# EAGLE design Esp12e_IR_repeater (EAGLE 9.6.1)
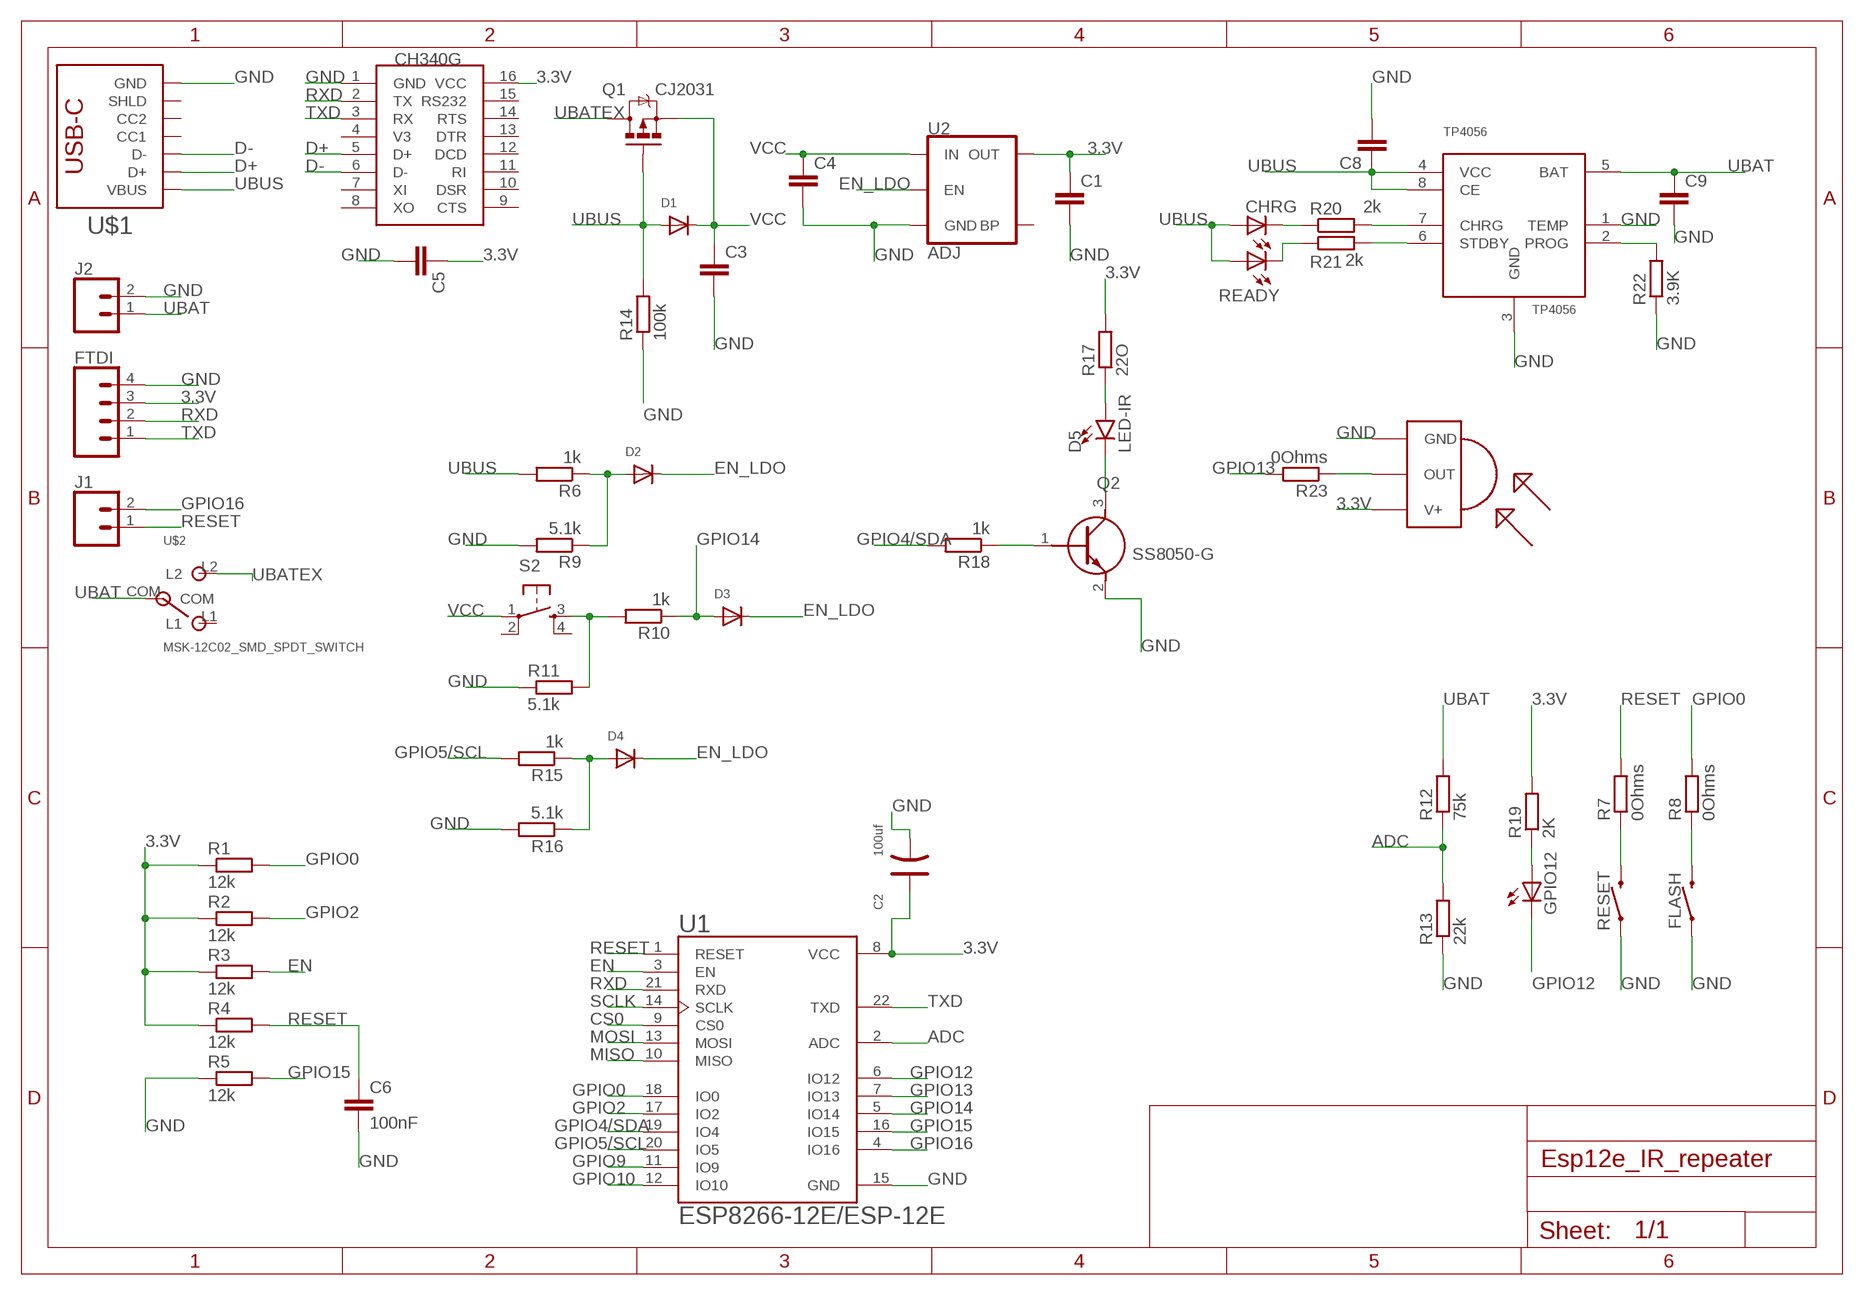
[diagram p0: schematic, sheet 1]

## Parts
C1  1uF  C_CHIP-0603(1608-METRIC)  [CAPC1608X85]
C2  100uf  TANTALUM-SMD-100UF-10V(AVX-B)  [AVX-B]
C3  1uF  C_CHIP-0603(1608-METRIC)  [CAPC1608X85]
C4  1uF  C_CHIP-0603(1608-METRIC)  [CAPC1608X85]
C5  1uF  C_CHIP-0603(1608-METRIC)  [CAPC1608X85]
C6  100nF  C-EUC0805  [C0805]
C8  10uF  C_CHIP-0603(1608-METRIC)  [CAPC1608X85]
C9  10uF  C_CHIP-0603(1608-METRIC)  [CAPC1608X85]
CHRG  LEDCHIPLED_0805  [CHIPLED_0805]
D1  DIODESOD-123  [SOD-123]
D2  DIODESOD-123  [SOD-123]
D3  DIODESOD-123  [SOD-123]
D4  DIODESOD-123  [SOD-123]
D5  LED-IR  LED-IRTSAL6100  [LED_5MM]
FLASH  RS032G05A3SM-SPST-MOMENTARY-SWSMD-1101NE  [TACTILE-SWITCH-1101NE]
FTDI  CONN_04  [1X04]
GPIO12  LEDCHIPLED_0805  [CHIPLED_0805]
J1  CONN_02  [1X02]
J2  CONN_02-JST-2-PTH-NO_SILK  [JST-2-PTH-NS]
Q1  CJ2031  MOSFET-PCHANNEL  [SOT23-3]
Q2  SS8050-G  [SOT95P240X115-3N]
R1  12k  R-EU_R0603  [R0603]
R2  12k  R-EU_R0603  [R0603]
R3  12k  R-EU_R0603  [R0603]
R4  12k  R-EU_R0603  [R0603]
R5  12k  R-EU_R0603  [R0603]
R6  1k  R-EU_R0603  [R0603]
R7  0Ohms  R-EU_R0603  [R0603]
R8  0Ohms  R-EU_R0603  [R0603]
R9  5.1k  R-EU_R0603  [R0603]
R10  1k  R-EU_R0603  [R0603]
R11  5.1k  R-EU_R0603  [R0603]
R12  75k  R-EU_R0603  [R0603]
R13  22k  R-EU_R0603  [R0603]
R14  100k  R-EU_R0603  [R0603]
R15  1k  R-EU_R0603  [R0603]
R16  5.1k  R-EU_R0603  [R0603]
R17  22O  R-EU_R0603  [R0603]
R18  1k  R-EU_R0603  [R0603]
R19  2K  R-EU_R0603  [R0603]
R20  2k  R-EU_R0603  [R0603]
R21  2k  R-EU_R0603  [R0603]
R22  3.9K  R-EU_R0603  [R0603]
R23  0Ohms  R-EU_R0603  [R0603]
READY  LEDCHIPLED_0805  [CHIPLED_0805]
RESET  RS032G05A3SM-SPST-MOMENTARY-SWSMD-1101NE  [TACTILE-SWITCH-1101NE]
S2  SWITCH-TACT_DTSM-6  [SWITCH-TACT_DTSM-6]
TP4056  TP4056  [SOP-8]
U1  ESP8266-12E/ESP-12E  [XCVR_ESP8266-12E/ESP-12E]
U2  ADJ  V_REG_MIC5205ADJ  [SOT23-5]
U$1  MOEKOE_USB_C_C393939  [MOEKOE_USBC_C393939]
U$2  MSK-12C02_SMD_SPDT_SWITCH  [MSK-12C02]
U$3  CH340G  [SOIC16]
U$4  TSOP1738  [TSOP17XX]

## Nets
3.3V: C1.1 C2.+ C5.1 FTDI.3 R1.1 R2.1 R3.1 R4.1 R17.2 R19.2 U1.8(VCC) U2.5(OUT) U$3.16(VCC) U$4.V+
ADC [Signal]: R12.1 R13.2 U1.2(ADC)
CS0 [Signal]: U1.9(CS0)
D+: U$1.A6(D+) U$1.B6(D+) U$3.5(D+)
D-: U$1.A7(D-) U$1.B7(D-) U$3.6(D-)
EN [Signal]: R3.2 U1.3(EN)
EN_LDO: D2.C D3.C D4.C U2.3(EN)
GND [GND]: C1.2 C2.- C3.2 C4.2 C5.2 C6.2 C8.2 C9.2 FLASH.1 FTDI.4 J2.2 Q2.2(E) R5.1 R9.2 R11.1 R13.1 R14.1 R16.2 R22.1 RESET.1 TP4056.1(TEMP) TP4056.3(GND) U1.15(GND) U2.2(GND) U$1.A1B12(GND) U$1.B1A12(GND) U$3.1(GND) U$4.GND
GPIO0 [Signal]: R1.2 R8.2 U1.18(IO0)
GPIO2 [Signal]: R2.2 U1.17(IO2)
GPIO4/SDA [Signal]: R18.2 U1.19(IO4)
GPIO5/SCL [Signal]: R15.2 U1.20(IO5)
GPIO9 [Signal]: U1.11(IO9)
GPIO10: U1.12(IO10)
GPIO12 [Signal]: GPIO12.C U1.6(IO12)
GPIO13 [Signal]: R23.2 U1.7(IO13)
GPIO14: D3.A R10.1 U1.5(IO14)
GPIO15 [Signal]: R5.2 U1.16(IO15)
GPIO16 [Signal]: J1.2 U1.4(IO16)
MISO [Signal]: U1.10(MISO)
MOSI [Signal]: U1.13(MOSI)
N$1: FLASH.2 R8.1
N$2 [Signal]: R7.1 RESET.2
N$3: D2.A R6.1 R9.1
N$4: D4.A R15.1 R16.1
N$5: R20.2 TP4056.7(CHRG)
N$6: R10.2 R11.2 S2.3
N$7: D5.A R17.1
N$8: D5.K(C) Q2.3(C)
N$9: Q2.1(B) R18.1
N$11: GPIO12.A R19.1
N$12: R21.2 TP4056.6(STDBY)
N$13: CHRG.C R20.1
N$14: R21.1 READY.C
N$15: R22.2 TP4056.2(PROG)
N$17: R23.1 U$4.OUT
RESET [Signal]: C6.1 J1.1 R4.2 R7.2 U1.1(RESET)
RXD [Signal]: FTDI.2 U1.21(RXD) U$3.2(TX)
SCLK [Signal]: U1.14(SCLK)
TXD [Signal]: FTDI.1 U1.22(TXD) U$3.3(RX)
UBAT [UBUS]: C9.1 J2.1 R12.2 TP4056.5(BAT) U$2.COM
UBATEX [UBUS]: Q1.3(D) U$2.L2
UBUS [UBUS]: C8.1 CHRG.A D1.A Q1.1(G) R6.2 R14.2 READY.A TP4056.4(VCC) TP4056.8(CE) U$1.A4B9(VBUS) U$1.B4A9(VBUS)
VCC: C3.1 C4.1 D1.C Q1.2(S) S2.1 U2.1(IN)
Unconnected: S2.2 S2.4 U2.4(BP) U$1.A5(CC1) U$1.B5(CC2) U$1.S1(SHLD) U$1.S2(SHLD) U$1.S3(SHLD) U$1.S4(SHLD) U$2.L1 U$3.4(V3) U$3.7(XI) U$3.8(XO) U$3.9(CTS) U$3.10(DSR) U$3.11(RI) U$3.12(DCD) U$3.13(DTR) U$3.14(RTS) U$3.15(RS232)

## Library data of the parts
C1 C3-C5 C8 C9 = Capacitor:C: Capacitor - Generic; CATEGORY: Capacitor; OC_NEWARK: unknown
C2 = OPL_Capacitor:TANTALUM-SMD-100UF-10V(AVX-B): 302020015; MPN: TAJB107M010#NJ
C6 = resistor:C-EU: CAPACITOR, European symbol; OC_NEWARK: unknown; SPICEPREFIX: C
CHRG GPIO12 READY = adafruit:LED: LED OSRAM: - CHIPLED LG R971, LG N971, LY N971, LG Q971, LY Q971, LO R971, LY R971 LH N974, LH R974 LS Q976, LO Q976, LY Q976 LO Q996 - Hyper CHIPLED LW Q18S LB Q993, LB Q99A, LB R99A - SideLED LS A670, LO A670, LY A670, LG A670, LP A670 LB A673, LV A673, LT A673, LW A673 LH A674 LY A675 LS A676, LA A676, LO A676, LY A676, LW A676 LS A679, LY A679, LG A679 - Hyper Micro SIDELED® LS Y876, LA Y876, LO Y876, LY Y876 LT Y87S - SmartLED LW L88C, LW L88S LB L89C, LB L89S, LG L890 LS L89K, LO L89K, LY L89K LS L896, LA L896, LO L896, LY L896 - TOPLED LS T670, LO T670, LY T670, LG T670, LP T670 LSG T670, LSP T670, LSY T670, LOP T670, LYG T670 LG T671, LOG T671, LSG T671 LB T673, LV T673, LT T673, LW T673 LH T674 LS T676, LA T676, LO T676, LY T676, LB T676, LH T676, LSB T676, LW T676 LB T67C, LV T67C, LT T67C, LS T67K, LO T67K, LY T67K, LW E67C LS E67B, LA E67B, LO E67B, LY E67B, LB E67C, LV E67C, LT E67C LW T67C LS T679, LY T679, LG T679 LS T770, LO T770, LY T770, LG T770, LP T770 LB T773, LV T773, LT T773, LW T773 LH T774 LS E675, LA E675, LY E675, LS T675 LS T776, LA T776, LO T776, LY T776, LB T776 LHGB T686 LT T68C, LB T68C - Hyper Mini TOPLED® LB M676 - Mini TOPLED Santana® LG M470 LS M47K, LO M47K, LY M47K Source: http://www.osram.convergy.de/; OC_NEWARK: unknown
D1 = adafruit:DIODE: Diode SMADIODE - SMA Surface Mount Package 20V 1A Schottky Diode Digikey: 641-1014-6-ND DO-1N4148 - Through Hole Small Current Diode SOD-123 20V 1 A (.5mV Vf) Schottky Diode - Digikey: MBRX120TPMSCT-ND SOD-323 10V 570mA (.38mV Vf, 3ns) Schottky Diode - Digikey: ZLLS410CT-ND SOD-523 30V 30mA Schottky Diode (RB751S-40TE61) - Digikey: RB751S-40TE61CT-ND SOT23-R/W - SOT23 Package (R = Solder Paste/Reflow Ovens, W = Hand-Soldering) BAT54Film 40V 300mA - Digikey: 497-7162-1-ND; OC_NEWARK: unknown; SPICEMODEL: DMOD; SPICEPREFIX: D
D2-D4 = adafruit:DIODE: Diode SMADIODE - SMA Surface Mount Package 20V 1A Schottky Diode Digikey: 641-1014-6-ND DO-1N4148 - Through Hole Small Current Diode SOD-123 20V 1 A (.5mV Vf) Schottky Diode - Digikey: MBRX120TPMSCT-ND SOD-323 10V 570mA (.38mV Vf, 3ns) Schottky Diode - Digikey: ZLLS410CT-ND SOD-523 30V 30mA Schottky Diode (RB751S-40TE61) - Digikey: RB751S-40TE61CT-ND SOT23-R/W - SOT23 Package (R = Solder Paste/Reflow Ovens, W = Hand-Soldering) BAT54Film 40V 300mA - Digikey: 497-7162-1-ND; OC_NEWARK: unknown
D5 = SparkFun-LED:LED-IR: Infrared LED (IR) Wavelength: 940nm Packages: TSAL6100 LTE302 - Side firing. Check SparkFun-Sensors.lbr for the receiver SparkFun Products: ZX Distance and Gesture Sensor <[https://www.sparkfun.com/products/12780]> Infrared Emitters and Detectors <https://www.sparkfun.com/products/241>; PROD_ID: DIO-12058
FLASH RESET = BeagleBone_Blue_R3:RS032G05A3SM-SPST-MOMENTARY-SW: 6x3.5mm 2-pin Momentary Switch (Push-button) Digikey Link <https://www.digikey.com/products/en?keywords=CKN10388TR-ND> Datasheet <https://media.digikey.com/pdf/Data%20Sheets/C&K/RS-032G05_-SM_RT.pdf>; OC_NEWARK: unknown; PROD_ID: SWCH-00815
FTDI = SparkFun-Connectors:CONN_04: Multi connection point. Often used as Generic Header-pin footprint for 0.1 inch spaced/style header connections On any of the 0.1 inch spaced packages, you can populate with these: Break Away Headers - Straight <https://www.sparkfun.com/products/116> (PRT-00116) Break Away Male Headers - Right Angle <https://www.sparkfun.com/products/553> (PRT-00553) Female Headers <https://www.sparkfun.com/products/115> (PRT-00115) Break Away Headers - Machine Pin <https://www.sparkfun.com/products/117> (PRT-00117) Break Away Female Headers - Swiss Machine Pin <https://www.sparkfun.com/products/743> (PRT-00743) For SCREWTERMINALS and SPRING TERMINALS visit here: Screw Terimnals on SparkFun.com <https://www.sparkfun.com/search/results?term=Screw+Terminals> (5mm/3.5mm/2.54mm spacing) This device is also useful as a general connection point to wire up your design to another part of your project. Our various solder wires solder well into these plated through hole pads. Hook-Up Wire - Assortment (Stranded, 22 AWG) <https://www.sparkfun.com/products/11375> (PRT-11375) Hook-Up Wire - Assortment (Solid Core, 22 AWG) <https://www.sparkfun.com/products/11367> (PRT-11367) View the entire wire category on our website here <https://www.sparkfun.com/categories/141> Special notes: Molex polarized connector foot print use with SKU : PRT-08231 with associated crimp pins and housings. 1MM SMD Version SKU: PRT-10208; OC_NEWARK: unknown; PROD_ID: CONN-09696
J1 J2 = SparkFun-Connectors:CONN_02: Multi connection point. Often used as Generic Header-pin footprint for 0.1 inch spaced/style header connections On any of the 0.1 inch spaced packages, you can populate with these: Break Away Headers - Straight <https://www.sparkfun.com/products/116> (PRT-00116) Break Away Male Headers - Right Angle <https://www.sparkfun.com/products/553> (PRT-00553) Female Headers <https://www.sparkfun.com/products/115> (PRT-00115) Break Away Headers - Machine Pin <https://www.sparkfun.com/products/117> (PRT-00117) Break Away Female Headers - Swiss Machine Pin <https://www.sparkfun.com/products/743> (PRT-00743) For SCREWTERMINALS and SPRING TERMINALS visit here: Screw Terimnals on SparkFun.com <https://www.sparkfun.com/search/results?term=Screw+Terminals> (5mm/3.5mm/2.54mm spacing) This device is also useful as a general connection point to wire up your design to another part of your project. Our various solder wires solder well into these plated through hole pads. Hook-Up Wire - Assortment (Stranded, 22 AWG) <https://www.sparkfun.com/products/11375> (PRT-11375) Hook-Up Wire - Assortment (Solid Core, 22 AWG) <https://www.sparkfun.com/products/11367> (PRT-11367) View the entire wire category on our website here <https://www.sparkfun.com/categories/141> Special notes: Molex polarized connector foot print use with: PRT-08233 with associated crimp pins and housings. 2.54_SCREWTERM for use with PRT-10571. 3.5mm Screw Terminal footprints for PRT-08084 5mm Screw Terminal footprints for use with PRT-08432
Q1 = User-Submitted:MOSFET-PCHANNEL: Generic PMOSFET IRLML2244 - TRANS-11153 (SOT-23 -20V -4.3A) (1.Gate 2.Source 3.Drain) FQP27P06 - COM-10349 <http://www.sparkfun.com/products/10349> (TO-220 -60V -27A) (1.Gate 2.Source 3.Drain); OC_NEWARK: unknown; PROD_ID: TRANS-08285; SPICEMODEL: PFET; SPICEPREFIX: M
Q2 = SS8050-G:SS8050-G: Bipolar Transistors - BJT NPN TRANSISTOR 1.5A 40V Source: Datasheet <http://www.comchiptech.com/admin/files/product/SS8050-G RevA181526.pdf> Check prices <https://pricing.snapeda.com/parts/SS8050-G/Comchip%20Technology/view-part?ref=eda>; AVAILABILITY: In Stock; DESCRIPTION: Bipolar (BJT) Transistor NPN 25V 1.5A 100MHz 300mW Surface Mount SOT-23-3; MF: Comchip Technology; MP: SS8050-G; PACKAGE: TO-236 Comchip; PRICE: None; PURCHASE-URL: https://pricing.snapeda.com/search/part/SS8050-G/?ref=eda
R1-R23 = resistor:R-EU_: RESISTOR, European symbol; OC_NEWARK: unknown; SPICEPREFIX: R
S2 = Esp32_buttons_V2:SWITCH-TACT_DTSM-6
TP4056 = TP4056:TP4056; AVAILABILITY: Unavailable; DESCRIPTION: Complete single cell Li-Ion battery with a constant current / constant voltage linear charger; MF: NanJing Top Power ASIC Corp.; MP: TP4056; PACKAGE: Package Analog Devices; PRICE: None
U1 = ESP8266-12E_ESP-12E:ESP8266-12E/ESP-12E: ESP-12E WiFi Module; AVAILABILITY: Unavailable; DESCRIPTION: This WiFi module has a 32-bit MCU micro and clock speeds supporting 80 MHz or 160 MHz. Supports the RTOS and integrated Wi-Fi MAC/BB/RF/PA/LNA, and has an on-board antenna.; MF: AI-Thinker; MP: ESP8266-12E/ESP-12E; OC_NEWARK: unknown; PACKAGE: None; PRICE: None
U2 = SparkFun-IC-Power:V_REG_MIC5205: V_REG MIC5205 Standard 3.3V, 5V, and Adjustable 150mA LDO voltage regulator in SOT-23 layout. Micrel part MIC5205. BP (by-pass) pin is used to lower output noise with 470pF cap, may be left open. On the adjustable version BP is used to set output.; OC_NEWARK: unknown; PROD_ID: VREG-12594; SPICEPREFIX: X
U$1 = pico32_remote_v1_1:MOEKOE_USB_C_C393939
U$2 = MSK-12C02 SMD Micro Slider Switch SPDT:MSK-12C02_SMD_SPDT_SWITCH: Footprint of the VIMEX MSK-12C02 SPDT SMD Switch Created by mzst on 17-Jan-2016
U$3 = ch340g:CH340G
U$4 = TSOP1738:TSOP1738: IR Receiver and Demodulator Check prices <https://pricing.snapeda.com/parts/TSOP1738./Vishay/view-part?ref=eda>; AVAILABILITY: Not in stock; DESCRIPTION: IR Remote Receiver 38KHz 35m 3-Pin; MF: Vishay; MP: TSOP1738.; PACKAGE: DIP-3 Vishay; PRICE: None

## Net classes
0 3.3v: width 0.25 mm
1 Signal: width 0.25 mm
2 GND: width 0.25 mm
3 UBUS: width 0.3 mm

## Board
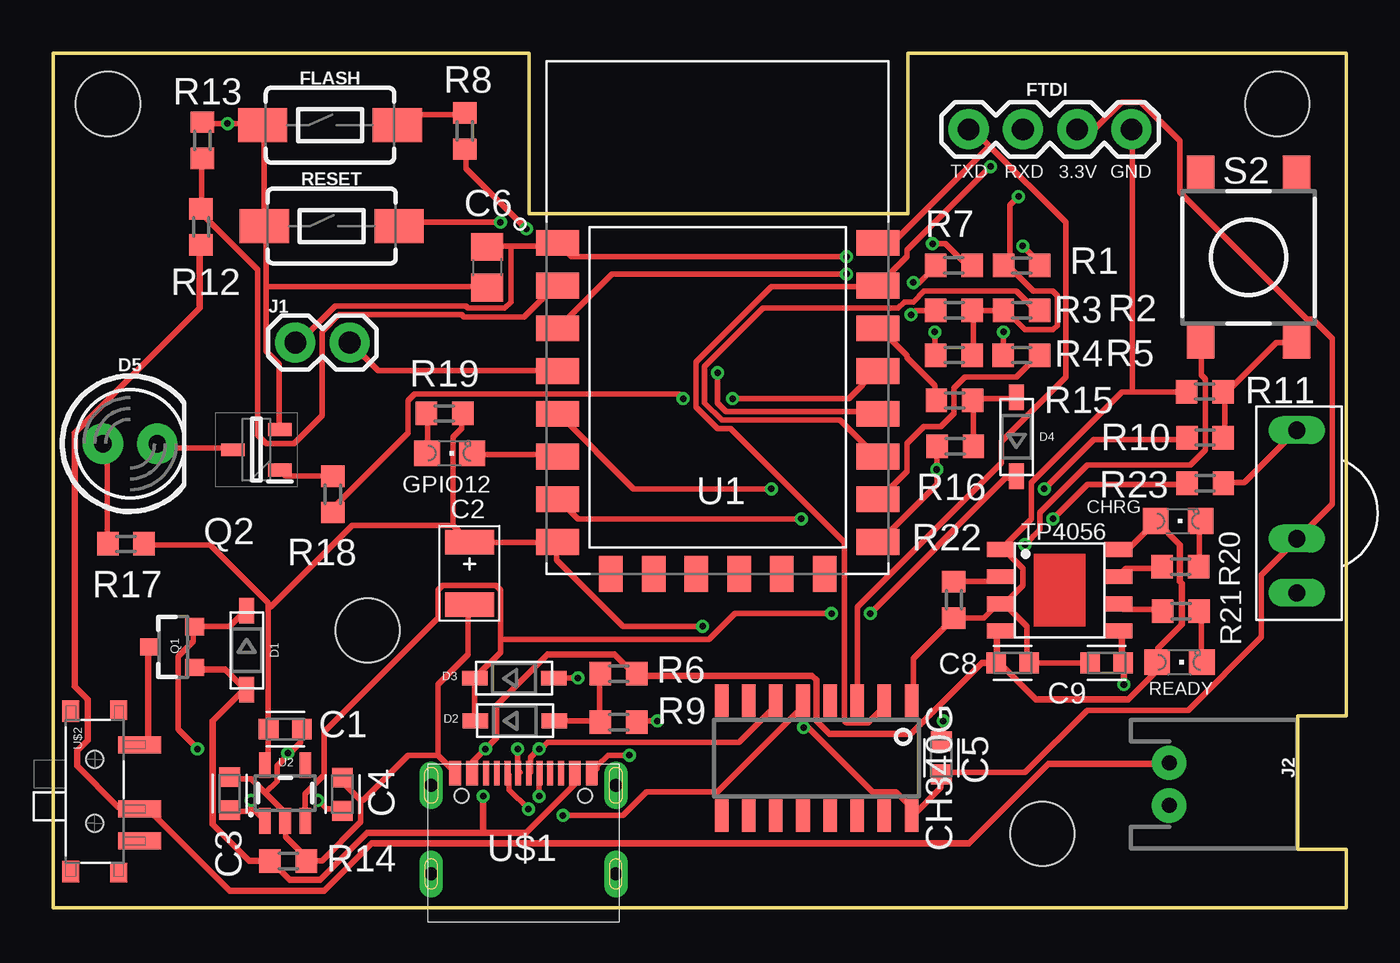
[diagram p1: board, top side]
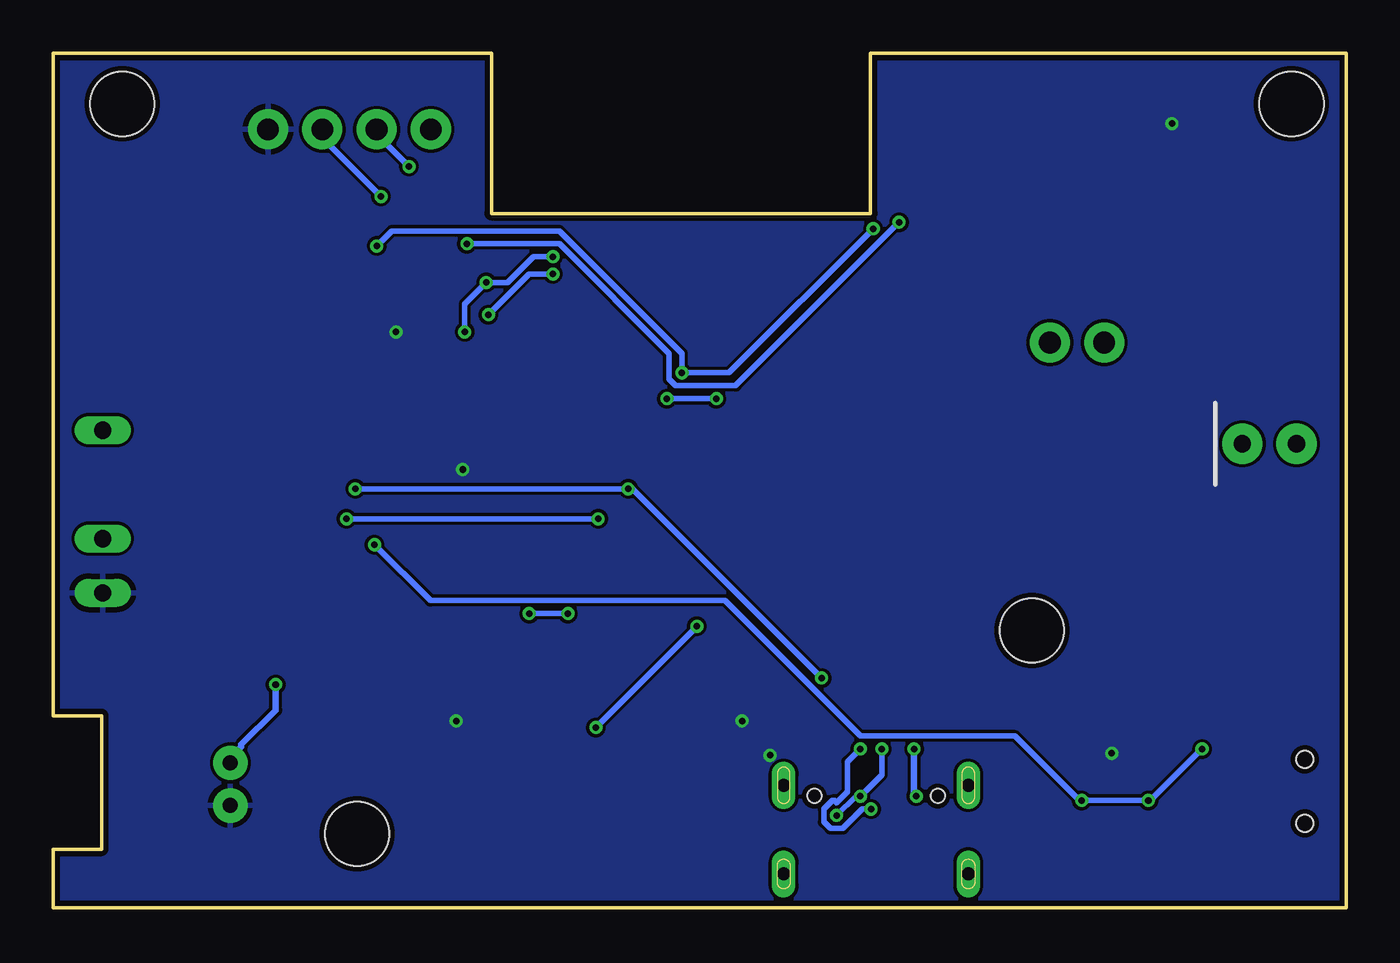
[diagram p2: board, bottom side, seen from below]

Size 60.5 x 40 mm. Coordinates in mm from the lower left corner, seen from the top.
Outline: 22.25,32.5 22.25,40 0,40 0,0 60.5,0 60.5,2.75 58.25,2.75 58.25,9 60.5,9 60.5,40 40,40 40,32.5 22.25,32.5
Copper layers (1*16): Top 0.035mm / dielectric 1.5mm / Bottom 0.035mm
Design rules "SeeedStudio_2layer_DRU_no_angle_20140221": minimum track width 6mil, minimum drill 12mil, track to track 6mil, track to pad 6mil, pad to pad 6mil, via to via 6mil, smd to smd 0mil, copper to edge 10mil, drill to drill 10mil, minimum pad ring 10mil, minimum via ring 6mil, stop-mask expansion 2mil, vias tented up to drill 100mil, thermal gap 10mil
Holes 3 mm at 2.56,37.63 46.29,3.46 57.27,37.63 14.71,12.99

### Footprints (pad centres in the part's own frame; a part is rotated, then mirrored left to right if it is on the bottom)
CAPC1608X85 = smd 0.921 x 0.97: 1 -0.775,0; 2 0.775,0
AVX-B = smd 1.143 x 2.286: + -1.46,0; - 1.46,0
C0805 = smd 1.3 x 1.5: 1 -0.95,0; 2 0.95,0
CHIPLED_0805 = smd 1.2 x 1.2: A 0,-1.05; C 0,1.05
SOD-123 = smd 1.2 x 0.7: A 1.85,0; C -1.85,0
LED_5MM = drill 0.813 pad 1.88: A -1.27,0; K 1.27,0
TACTILE-SWITCH-1101NE = smd 2.3 x 1.6: 1 -3.15,0; 2 3.15,0
1X04 = drill 1.016 pad 1.88: 1 0,0; 2 2.54,0; 3 5.08,0; 4 7.62,0
1X02 = drill 1.016 pad 1.88: 1 0,0; 2 2.54,0
JST-2-PTH-NS = drill 0.7 pad 1.6: 1 -1,0; 2 1,0
SOT23-3 = smd 0.8 x 0.9: 1 -0.95,-1; 2 0.95,-1; 3 0,1.1
SOT95P240X115-3N = smd 1.1 x 0.6: 1 -1.1,0.95; 2 -1.1,-0.95; 3 1.1,0
R0603 = smd 1 x 1.1: 1 -0.85,0; 2 0.85,0
SWITCH-TACT_DTSM-6 = smd 1.55 x 1.3: 1 -3.975,2.25; 2 3.975,2.25; 3 -3.975,-2.25; 4 3.975,-2.25
SOP-8 = smd 1.3 x 0.7: 1 -2.75,1.905; 2 -2.75,0.635; 3 -2.75,-0.635; 4 -2.75,-1.905; 5 2.75,-1.905; 6 2.75,-0.635; 7 2.75,0.635; 8 2.75,1.905
XCVR_ESP8266-12E/ESP-12E = smd 2 x 1.2: 1 -7.5,7; 2 -7.5,5; 3 -7.5,3; 4 -7.5,1; 5 -7.5,-1; 6 -7.5,-3; 7 -7.5,-5; 8 -7.5,-7; 15 7.5,-7; 16 7.5,-5; 17 7.5,-3; 18 7.5,-1; 19 7.5,1; 20 7.5,3; 21 7.5,5; 22 7.5,7 | smd 1.1 x 1.7: 9 -5,-8.5; 10 -3,-8.5; 11 -1,-8.5; 12 1,-8.5; 13 3,-8.5; 14 5,-8.5
SOT23-5 = smd 0.55 x 1.2: 1 -0.95,-1.3; 2 0,-1.3; 3 0.95,-1.3; 4 0.95,1.3; 5 -0.95,1.3
MOEKOE_USBC_C393939 = smd 0.55 x 1.15: A1B12 -3.2,0.575; A4B9 -2.4,0.575; B1A12 3.2,0.575; B4A9 2.4,0.575 | smd 0.275 x 1.15: A5 -1.25,0.575; A6 -0.25,0.575; A7 0.25,0.575; B5 1.75,0.575; B6 0.75,0.575; B7 -0.75,0.575; B8 1.25,0.575 | smd 0.3 x 1.15: A8 -1.75,0.575 | drill 0.6 pad 1 long: S1 -4.32,0; S2 4.32,0; S3 -4.32,-4.15; S4 4.32,-4.15 | hole 0.65: 2.89,-0.5; -2.89,-0.5
MSK-12C02 = smd 0.8 x 2: COM 0.823,2.1; L1 2.323,2.1; L2 -2.177,2.1 | smd 1 x 0.8: GND@1 -3.75,-1.125; GND@4 3.75,-1.125 | smd 0.9 x 0.8: GND@2 -3.8,1.125; GND@3 3.8,1.125 | hole 0.8: -1.5,0; 1.5,0
SOIC16 = smd 0.635 x 1.524: 1 -4.445,-2.695; 2 -3.175,-2.695; 3 -1.905,-2.695; 4 -0.635,-2.695; 5 0.635,-2.695; 6 1.905,-2.695; 7 3.175,-2.695; 8 4.445,-2.695; 9 4.445,2.695; 10 3.175,2.695; 11 1.905,2.695; 12 0.635,2.695; 13 -0.635,2.695; 14 -1.905,2.695; 15 -3.175,2.695; 16 -4.445,2.695
TSOP17XX = drill 0.813 long: GND -3.81,0; OUT 3.81,0; V+ -1.27,0

### Placement (x,y rotation side)
C1  10.85,8.37 0 top
C2  19.47,15.66 270 top
C3  8.24,5.36 90 top
C4  13.53,5.32 90 top
C5  41.55,7.03 90 top
C6  20.3,29.99 270 top
C8  44.9,11.47 0 top
C9  49.3,11.47 180 top
CHRG  52.63,18.11 270 top
D1  9.05,12.06 270 top
D2  21.6,8.77 0 top
D3  21.57,10.76 0 top
D4  45.08,22.05 90 top
D5  3.59,21.73 0 top
FLASH  12.94,36.64 0 top
FTDI  42.84,36.45 0 top
GPIO12  18.54,21.29 270 top
J1  11.32,26.46 0 top
J2  52.22,5.79 270 top
Q1  5.61,12.22 90 top
Q2  9.5,21.45 180 top
R1  45.31,30.07 0 top
R2  45.31,27.97 0 top
R3  42.15,27.98 180 top
R4  42.15,25.88 180 top
R5  45.31,25.87 0 top
R6  26.45,10.97 0 top
R7  42.14,30.08 180 top
R8  19.25,36.37 270 top
R9  26.45,8.7 0 top
R10  53.9,22.02 0 top
R11  53.88,24.17 0 top
R12  6.91,31.88 270 top
R13  6.97,35.93 270 top
R14  10.99,2.19 180 top
R15  42.17,23.75 180 top
R16  42.2,21.61 180 top
R17  3.4,17.04 0 top
R18  13.08,19.36 270 top
R19  18.31,23.15 0 top
R20  52.74,15.97 180 top
R21  52.77,13.89 180 top
R22  42.15,14.42 90 top
R23  53.91,19.88 180 top
READY  52.7,11.5 270 top
RESET  13.02,31.92 0 top
S2  55.94,30.45 90 top
TP4056  47.09,14.87 0 top
U1  31.09,24.13 0 top
U2  10.85,5.38 0 top
U$1  22,5.74 0 top
U$2  1.94,5.46 270 top
U$3  35.72,7.01 180 top
U$4  58.2,18.55 90 top

### Tracks (layer width: path | path; a pad name or v marks a point on that pad's centre or on a via)
3.3V  (via drill 0.3)
  Top 0.25: 18.71,17.91 18.71,22.03 19.11,22.43 19.11,23.14 R19.2 | 18.71,17.91 19.42,17.2 C2.+ 19.52,17.1 23.54,17.1 U1.8 23.54,17 23.54,16.3 26.66,13.18 v30.38,13.18 | U2.5 9.96,6.74 10.06,6.84 10.06,8.35 C1.1 10.06,8.45 10.06,14.08 | 10.06,14.08 10.06,14.29 7.34,17 4.33,17 R17.2 | 18.71,17.91 13.98,17.91 10.16,14.08 10.06,14.08 | R4.1 43.06,25.95 43.06,27.97 R3.1 43.16,27.97 44.37,27.97 R2.1 44.57,27.97 45.47,27.06 46.78,27.06 46.98,27.26 46.98,28.67 46.78,28.87 45.87,28.87 44.77,29.98 44.47,29.98 R1.1 44.77,30.08 44.77,32.9 v45.17,33.3 | FTDI.3 47.99,36.52 48.79,36.52 50,37.73 50.9,37.73 52.71,35.91 52.71,33.5 58.65,27.56 58.95,27.56 59.86,26.66 59.86,18.91 58.25,17.3 U$4.V+ 58.15,17.2 56.54,15.59 56.54,12.68 53.12,9.26 48.39,9.26 45.47,6.34 41.65,6.34 C5.1 41.55,6.24 41.55,5.63 40.24,4.33 U$3.16 40.34,4.53 39.44,5.43 38.33,5.43 35.31,8.45 v35.11,8.45
  Bottom 0.25: v45.17,33.3 47.89,36.02 47.89,36.42 FTDI.3 | v35.11,8.45 v30.38,13.18
ADC
  Top 0.25: R13.2 6.94,35.01 6.94,32.8 R12.1 6.94,32.7 6.94,32.49 9.56,29.88 9.56,22.13 9.96,21.73 11.27,21.73 12.57,23.04 12.57,26.96 13.38,27.77 19.11,27.77 19.21,27.66 22.03,27.66 23.54,29.17 U1.2
D+  (via drill 0.3)
  Top 0.25: v21.73,7.44 21.73,6.44 21.83,6.34 U$1.A6 | v22.74,5.23 22.74,6.24 U$1.B6 | v23.84,4.33 26.66,4.33 27.77,5.43 31.09,5.43 35.01,9.36 35.01,9.66 U$3.5
  Bottom 0.25: v21.73,7.44 21.73,6.24 v22.74,5.23 22.94,5.23 v23.84,4.33
D-  (via drill 0.3)
  Top 0.25: v22.23,4.63 21.33,5.53 21.33,6.24 U$1.B7 | U$1.A7 22.33,6.34 22.33,7.04 v22.74,7.44 22.84,7.44 23.14,7.75 32.09,7.75 33.8,9.46 33.8,9.66 U$3.6
  Bottom 0.25: v22.23,4.63 22.64,4.63 23.54,3.72 24.14,3.72 24.45,4.02 24.45,4.63 24.04,5.03 23.94,5.03 23.84,4.93 23.34,5.43 23.34,6.84 v22.74,7.44
EN  (via drill 0.3)
  Top 0.25: v40.14,27.77 40.34,27.97 41.25,27.97 R3.2 | v37.12,29.68 26.16,29.68 23.64,27.16 U1.3
  Bottom 0.25: v40.14,27.77 38.23,29.68 v37.12,29.68
EN_LDO  (via drill 0.3)
  Top 0.25: 20.93,12.57 20.93,11.97 D3.C 19.72,10.66 19.72,8.85 D2.C | 20.93,12.57 20.93,14.89 20.72,15.09 18.21,15.09 18.01,14.89 18.01,13.58 12.68,8.25 12.68,6.24 11.77,5.33 11.77,4.12 U2.3 | v38.23,13.78 44.57,20.12 45.07,20.12 D4.C | v36.42,13.78 31.89,13.78 30.68,12.57 20.93,12.57
  Bottom 0.25: v36.42,13.78 v38.23,13.78
GND  (via drill 0.3)
  Top 0.25: R13.1 7.04,36.72 v8.15,36.72 9.76,36.72 FLASH.1 9.86,36.62 9.86,31.99 RESET.1 9.96,31.89 9.96,29.07 | 9.96,29.07 9.96,26.05 10.56,25.45 10.56,22.43 Q2.2 | 9.96,29.07 20.22,29.07 C6.2 | C9.2 48.49,11.47 C8.2 45.57,11.57 45.57,13.18 44.57,14.19 44.37,14.19 TP4056.3 | TP4056.3 44.26,14.29 43.56,13.58 R22.1 42.05,13.48 40.24,11.67 40.24,9.76 U$3.1 | 50.5,24.14 50,24.14 45.77,19.92 45.77,18.21 44.37,16.8 TP4056.1 44.47,16.8 45.37,15.89 45.37,15.09 44.57,14.29 TP4056.3 | 50.5,24.14 53.02,24.14 R11.1 | 9.91,5.38 10.76,4.53 10.76,4.12 U2.2 10.87,4.02 10.87,3.32 11.87,2.31 R14.1 11.87,2.21 12.57,2.21 14.39,4.02 14.39,5.03 | 9.91,5.38 9.26,6.04 8.25,6.04 C3.2 | 11.02,7.19 10.46,6.64 10.46,5.93 9.91,5.38 | 11.02,7.19 11.57,7.75 11.57,8.35 C1.2 | 14.39,5.03 13.58,5.83 13.58,6.04 C4.2 | 18.01,7.14 18.71,6.44 18.71,6.34 U$1.A1B12 | 18.01,7.14 16.6,7.14 14.49,5.03 14.39,5.03 | 18.01,7.14 18.01,10.46 19.42,11.87 19.42,14.19 C2.- | R16.2 41.35,21.53 v41.35,20.52 41.35,19.82 38.63,17.1 U1.15 | v41.65,8.75 41.65,7.85 C5.2 | v28.27,8.75 27.36,8.75 R9.2 | v44.47,26.96 44.47,25.95 R5.1 | v26.96,7.14 25.95,7.14 25.45,6.64 25.45,6.54 25.25,6.34 U$1.B1A12 | v10.96,7.24 11.02,7.19 | 50.5,24.14 50.5,36.42 FTDI.4
  pour Bottom: -0.76,40.72 61.05,40.72 61.07,40.73 61.07,-0.84 61.09,-0.86 -0.8,-0.86 -0.8,-0.87 -0.8,40.67
GPIO0  (via drill 0.3)
  Top 0.25: v22.13,31.79 19.32,34.61 19.32,35.51 R8.2 | v31.09,25.05 31.09,23.64 31.49,23.24 38.43,23.24 38.53,23.14 U1.18 | v45.37,30.98 46.08,30.28 46.08,30.08 R1.2
  Bottom 0.25: v22.13,31.79 28.87,25.05 v31.09,25.05 31.09,25.95 36.82,31.69 44.67,31.69 v45.37,30.98
GPIO2
  Top 0.25: R2.2 46.08,28.07 45.87,28.07 45.07,28.87 40.74,28.87 40.24,28.37 39.84,28.37 39.54,28.07 33.2,28.07 30.48,25.35 30.48,23.64 31.29,22.84 36.82,22.84 38.53,21.13 U1.17
GPIO4/SDA  (via drill 0.3)
  Top 0.25: v29.48,23.84 29.27,24.04 16.9,24.04 16.6,23.74 16.6,22.23 13.18,18.81 13.18,18.51 R18.2 | v31.79,23.84 37.22,23.84 38.53,25.15 U1.19
  Bottom 0.25: v31.79,23.84 v29.48,23.84
GPIO5/SCL
  Top 0.25: R15.2 41.25,23.84 41.25,24.45 39.94,25.75 39.94,25.85 38.63,27.16 U1.20
GPIO12
  Top 0.25: GPIO12.C 19.62,21.23 23.54,21.23 U1.6
GPIO13  (via drill 0.3)
  Top 0.25: v46.78,18.21 48.39,19.82 53.02,19.82 R23.2 | v35.01,18.21 24.55,18.21 23.64,19.11 U1.7
  Bottom 0.25: v35.01,18.21 v46.78,18.21
GPIO14  (via drill 0.3)
  Top 0.25: v46.38,19.62 48.69,21.93 53.02,21.93 R10.1 | v33.6,19.62 27.16,19.62 23.64,23.14 U1.5 | v24.55,10.76 23.44,10.76 D3.A
  Bottom 0.25: v46.38,19.62 v33.6,19.62 33.4,19.62 v24.55,10.76
GPIO15
  Top 0.25: R5.2 46.08,25.85 45.07,24.85 42.65,24.85 42.15,24.34 42.15,23.14 41.55,22.53 40.74,22.53 39.94,21.73 39.94,20.42 38.63,19.11 U1.16
GPIO16
  Top 0.25: U1.4 23.54,25.15 15.19,25.15 13.88,26.46 J1.2
N$1
  Top 0.25: R8.1 19.21,37.12 16.5,37.12 16.1,36.72 FLASH.2
N$2  (via drill 0.3)
  Top 0.25: v41.15,31.09 41.75,31.09 42.76,30.08 42.96,30.08 R7.1 | v20.93,32.09 16.3,32.09 16.2,31.99 RESET.2
  Bottom 0.25: v41.15,31.09 36.82,31.09 31.69,25.95 31.69,24.75 31.39,24.45 28.57,24.45 v20.93,32.09
N$3
  Top 0.25: D2.A 23.54,8.75 25.55,8.75 R9.1 25.55,8.85 25.55,10.96 R6.1
N$4
  Top 0.25: D4.A 45.07,23.84 43.06,23.84 R15.1 43.06,23.64 43.06,21.63 R16.1
N$5
  Top 0.25: R20.2 51.81,15.89 50.2,15.89 49.9,15.59 TP4056.7
N$6
  Top 0.25: R10.2 54.83,22.03 54.83,24.14 R11.2 54.93,24.14 57.24,26.46 58.15,26.46 S2.3
N$7
  Top 0.25: R17.1 2.52,17.1 2.52,21.63 2.41,21.73 D5.A
N$8
  Top 0.25: Q2.3 8.35,21.53 5.13,21.53 4.93,21.73 D5.K
N$9
  Top 0.25: R18.1 10.87,20.22 10.66,20.42 Q2.1
N$11
  Top 0.25: R19.1 17.5,23.14 17.5,21.33 GPIO12.A
N$12
  Top 0.25: R21.2 51.91,13.98 50.1,13.98 49.9,14.19 TP4056.6
N$13
  Top 0.25: R20.1 53.62,15.99 53.62,18.11 CHRG.C
N$14
  Top 0.25: R21.1 53.72,13.88 53.72,11.57 READY.C
N$15
  Top 0.25: R22.2 42.15,15.29 44.06,15.29 44.26,15.49 TP4056.2
N$17
  Top 0.25: R23.1 54.83,19.92 55.73,19.92 58.15,22.33 U$4.OUT
RESET  (via drill 0.3)
  Top 0.25: v41.25,26.96 41.25,25.95 R4.2 | v40.24,29.27 40.54,29.27 41.25,29.98 R7.2 | 21.43,30.98 23.44,30.98 23.54,31.09 U1.1 23.64,31.09 24.25,30.48 v37.12,30.48 | 21.43,30.98 20.32,30.98 C6.1 | 21.43,30.98 21.43,28.37 21.13,28.07 19.42,28.07 19.32,28.17 13.18,28.17 11.57,26.56 11.37,26.56 J1.1
  Bottom 0.25: v41.25,26.96 41.25,28.27 v40.24,29.27 39.23,29.27 38.03,30.48 v37.12,30.48
RXD  (via drill 0.3)
  Top 0.25: U$3.2 38.83,9.66 38.83,9.36 38.13,8.65 37.12,8.65 37.02,8.75 37.02,17.1 31.69,22.43 31.09,22.43 30.08,23.44 30.08,25.55 33.6,29.07 38.53,29.07 U1.21 38.63,29.17 39.94,30.48 39.94,30.78 v43.86,34.71
  Bottom 0.25: v43.86,34.71 45.37,36.22 45.37,36.42 FTDI.2
TXD
  Top 0.25: 43.81,35.66 43.06,36.42 42.86,36.42 FTDI.1 | 43.81,35.66 47.38,32.09 47.38,24.85 44.37,21.83 44.37,20.82 37.62,14.08 37.62,9.76 U$3.3 | 43.81,35.66 39.34,31.19 38.63,31.19 U1.22
UBAT  (via drill 0.3)
  Top 0.3: TP4056.5 49.9,12.88 50,12.78 50,11.57 C9.1 50.1,11.37 v50.1,10.46 | R12.2 6.84,30.98 6.84,28.07 1.01,22.23 1.01,10.36 1.61,9.76 1.61,7.85 1.11,7.34 1.11,6.64 3.02,4.73 4.02,4.73 U$2.COM 4.12,4.53 4.53,4.53 8.25,0.81 12.68,0.81 14.89,3.02 42.86,3.02 46.58,6.74 52.21,6.74 J2.1
  Bottom 0.3: v50.1,10.46 50.1,9.26 51.71,7.65 51.71,7.54 52.21,7.04 52.21,6.84 J2.1
UBATEX
  Top 0.3: Q1.3 4.43,12.17 4.43,7.95 4.12,7.65 U$2.L2
UBUS  (via drill 0.3)
  Top 0.3: Q1.1 6.64,11.17 8.05,11.17 8.95,10.26 D1.A 8.85,10.16 7.44,8.75 7.44,3.92 9.15,2.21 10.06,2.21 R14.2 10.26,2.11 11.07,1.31 12.47,1.31 14.69,3.52 20.12,3.52 | 20.12,3.52 22.13,3.52 24.34,5.73 24.34,6.24 U$1.B4A9 | U$1.A4B9 19.62,6.34 19.62,6.84 v20.22,7.44 20.72,7.95 20.72,9.46 23.14,11.87 26.26,11.87 27.06,11.07 27.26,11.07 R6.2 27.36,10.87 35.51,10.87 35.71,10.66 35.71,8.75 36.32,8.15 40.14,8.15 43.46,11.47 43.96,11.47 C8.1 | C8.1 44.16,11.57 44.16,12.78 44.26,12.88 TP4056.4 | TP4056.8 49.9,16.8 50.3,16.8 51.51,18.01 CHRG.A 51.61,18.11 52.71,17 52.71,15.29 52.81,15.19 52.81,13.28 51.71,12.17 51.71,11.57 READY.A 51.61,11.37 51.61,11.07 50.3,9.76 45.97,9.76 44.26,11.47 C8.1 | v20.12,5.23 20.12,3.52
  Bottom 0.3: v20.12,5.23 20.22,5.33 v20.22,7.44
VCC  (via drill 0.3)
  Top 0.25: D1.C 8.95,13.88 8.25,13.18 6.64,13.18 Q1.2 6.54,13.08 6.54,12.47 5.83,11.77 5.83,8.35 v6.74,7.44 | 9.26,4.53 9.46,4.53 9.86,4.12 U2.1 | 9.26,4.53 8.25,4.53 C3.1 | v12.37,5.03 12.78,4.63 13.48,4.63 C4.1 | 9.26,4.53 v9.26,5.03 | v45.47,17 46.17,17.71 46.17,18.51 48.39,20.72 53.22,20.72 53.92,21.43 53.92,24.75 53.72,24.95 53.72,26.46 S2.1
  Bottom 0.25: v45.47,17 42.86,14.39 29.07,14.39 22.74,8.05 15.49,8.05 12.47,5.03 v12.37,5.03 v9.26,5.03 9.15,5.03 v6.74,7.44

### Text on the board
tNames: TXD | RXD | 3.3V | GND